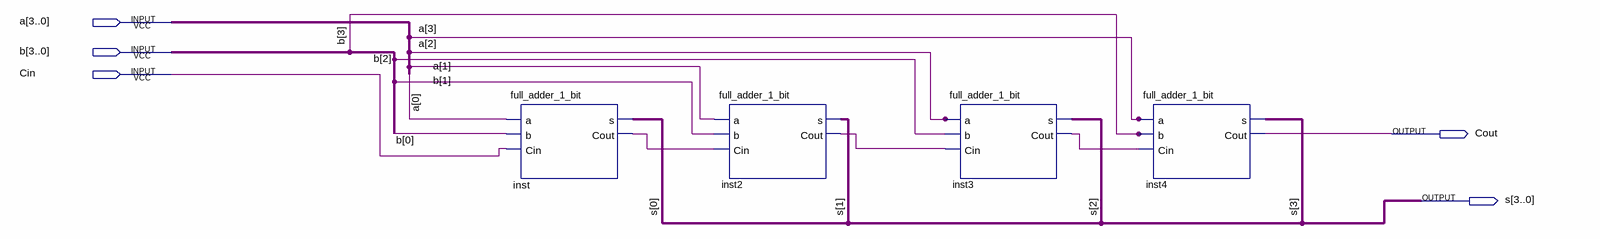
[diagram p0: schematic sheet]
// Quartus schematic full_adder_4b.bdf as structural Verilog: 4 symbols, 5 pins
module full_adder_4b (
  input  [3:0] a,
  input  [3:0] b,
  input  Cin,
  output Cout,
  output [3:0] s
);

  wire inst2_cout, inst3_cout, inst_cout;

  full_adder_1_bit inst (.a(a[0]), .b(b[0]), .Cin(Cin), .s(s[0]), .Cout(inst_cout));
  full_adder_1_bit inst2 (.a(a[1]), .b(b[1]), .Cin(inst_cout), .s(s[1]), .Cout(inst2_cout));
  full_adder_1_bit inst3 (.a(a[2]), .b(b[2]), .Cin(inst2_cout), .s(s[2]), .Cout(inst3_cout));
  full_adder_1_bit inst4 (.a(a[3]), .b(b[3]), .Cin(inst3_cout), .s(s[3]), .Cout(Cout));
endmodule
